# EAGLE design Tesseract (EAGLE 6.6.0)
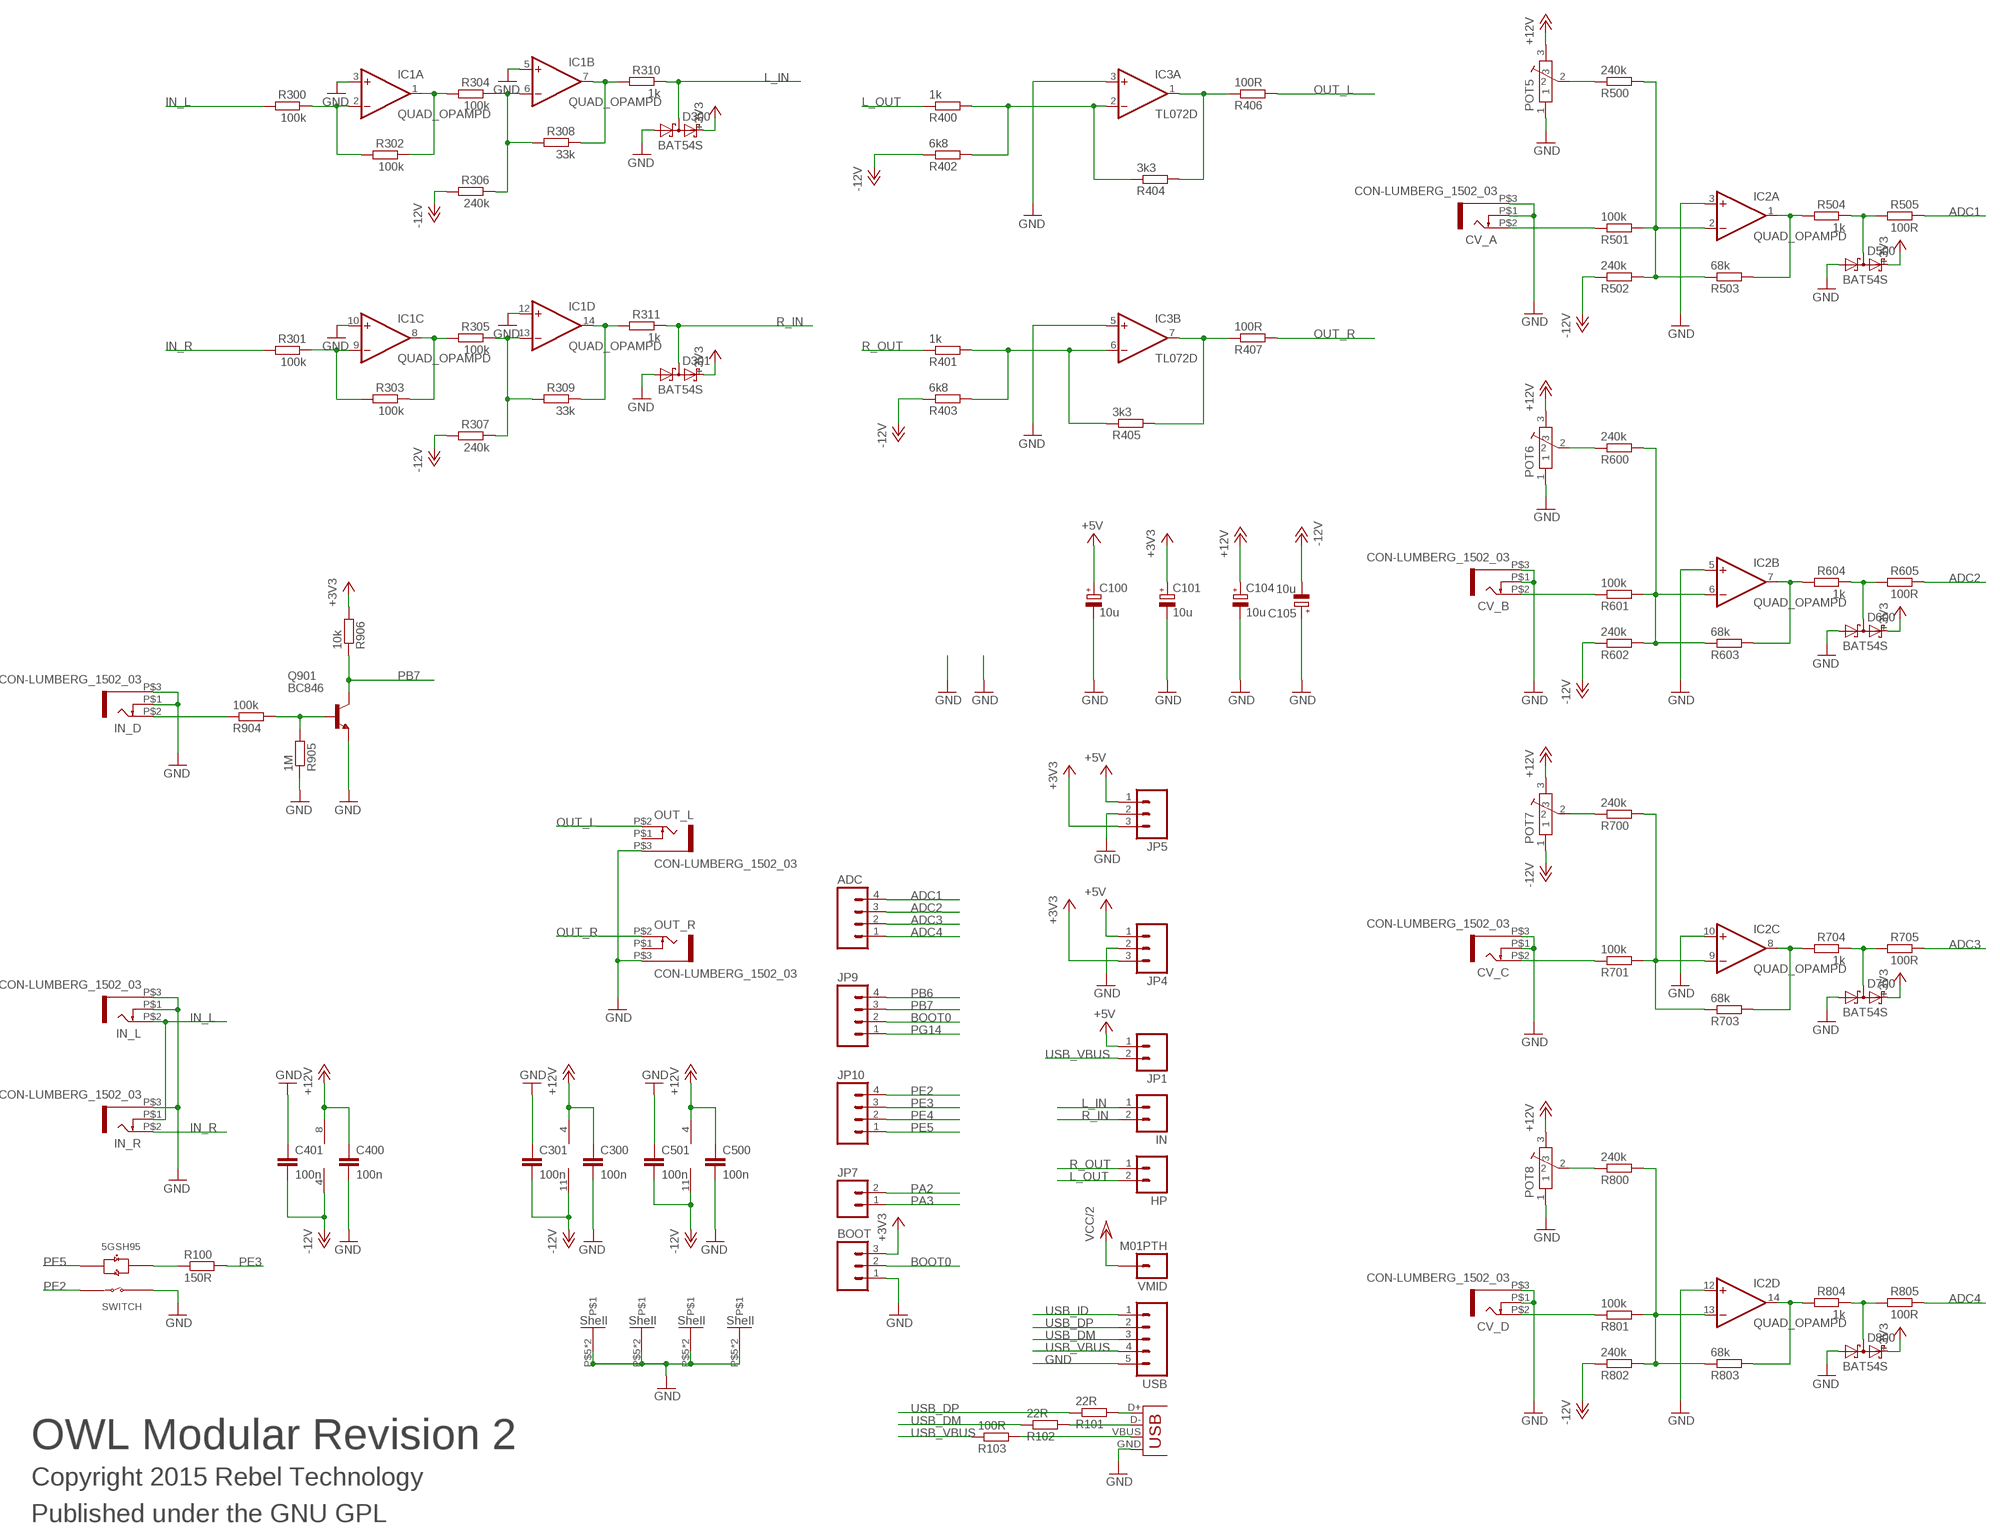
[diagram p0: schematic, sheet 1]

## Parts
ADC  M04PTH  [1X04]
BOOT  M03PTH  [1X03]
C100  10u  CPOL-EUA  [PANASONIC_A]
C101  10u  CPOL-EUA  [PANASONIC_A]
C104  10u  CPOL-EUA  [PANASONIC_A]
C105  10u  CPOL-EUA  [PANASONIC_A]
C300  100n  C-EUC0603  [C0603]
C301  100n  C-EUC0603  [C0603]
C400  100n  C-EUC0603  [C0603]
C401  100n  C-EUC0603  [C0603]
C500  100n  C-EUC0603  [C0603]
C501  100n  C-EUC0603  [C0603]
CV_A  CON-LUMBERG_1502_03  [CON-LUMBERG_1502_03]
CV_B  CON-LUMBERG_1502_03  [CON-LUMBERG_1502_03]
CV_C  CON-LUMBERG_1502_03  [CON-LUMBERG_1502_03]
CV_D  CON-LUMBERG_1502_03  [CON-LUMBERG_1502_03]
D300  BAT54S  [SOT23]
D301  BAT54S  [SOT23]
D500  BAT54S  [SOT23]
D600  BAT54S  [SOT23]
D700  BAT54S  [SOT23]
D800  BAT54S  [SOT23]
HP  M02PTH  [1X02]
IC1  QUAD_OPAMPD  [SO14]
IC2  QUAD_OPAMPD  [SO14]
IC3  TL072D  [SO08]
IN  M02PTH  [1X02]
IN_D  CON-LUMBERG_1502_03  [CON-LUMBERG_1502_03]
IN_L  CON-LUMBERG_1502_03  [CON-LUMBERG_1502_03]
IN_R  CON-LUMBERG_1502_03  [CON-LUMBERG_1502_03]
JP1  M02PTH  [1X02]
JP4  M03PTH  [1X03]
JP5  M03PTH  [1X03]
JP7  M02PTH  [1X02]
JP9  M04PTH  [1X04]
JP10  M04PTH  [1X04]
OUT_L  CON-LUMBERG_1502_03  [CON-LUMBERG_1502_03]
OUT_R  CON-LUMBERG_1502_03  [CON-LUMBERG_1502_03]
POT5  POT-ALPS-RK09L1140  [POT-ALPS-RK09L1140]
POT6  POT-ALPS-RK09L1140  [POT-ALPS-RK09L1140]
POT7  POT-ALPS-RK09L1140  [POT-ALPS-RK09L1140]
POT8  POT-ALPS-RK09L1140  [POT-ALPS-RK09L1140]
Q901  BC846  [SOT23]
R100  150R  R-EU_0603  [0603]
R101  22R  R-EU_0603  [0603]
R102  22R  R-EU_0603  [0603]
R103  100R  R-EU_0603  [0603]
R300  100k  R-EU_0603  [0603]
R301  100k  R-EU_0603  [0603]
R302  100k  R-EU_0603  [0603]
R303  100k  R-EU_0603  [0603]
R304  100k  R-EU_0603  [0603]
R305  100k  R-EU_0603  [0603]
R306  240k  R-EU_0603  [0603]
R307  240k  R-EU_0603  [0603]
R308  33k  R-EU_0603  [0603]
R309  33k  R-EU_0603  [0603]
R310  1k  R-EU_0603  [0603]
R311  1k  R-EU_0603  [0603]
R400  1k  R-EU_0603  [0603]
R401  1k  R-EU_0603  [0603]
R402  6k8  R-EU_0603  [0603]
R403  6k8  R-EU_0603  [0603]
R404  3k3  R-EU_0603  [0603]
R405  3k3  R-EU_0603  [0603]
R406  100R  R-EU_0603  [0603]
R407  100R  R-EU_0603  [0603]
R500  240k  R-EU_0603  [0603]
R501  100k  R-EU_0603  [0603]
R502  240k  R-EU_0603  [0603]
R503  68k  R-EU_0603  [0603]
R504  1k  R-EU_0603  [0603]
R505  100R  R-EU_0603  [0603]
R600  240k  R-EU_0603  [0603]
R601  100k  R-EU_0603  [0603]
R602  240k  R-EU_0603  [0603]
R603  68k  R-EU_0603  [0603]
R604  1k  R-EU_0603  [0603]
R605  100R  R-EU_0603  [0603]
R700  240k  R-EU_0603  [0603]
R701  100k  R-EU_0603  [0603]
R703  68k  R-EU_0603  [0603]
R704  1k  R-EU_0603  [0603]
R705  100R  R-EU_0603  [0603]
R800  240k  R-EU_0603  [0603]
R801  100k  R-EU_0603  [0603]
R802  240k  R-EU_0603  [0603]
R803  68k  R-EU_0603  [0603]
R804  1k  R-EU_0603  [0603]
R805  100R  R-EU_0603  [0603]
R904  100k  R-EU_0603  [0603]
R905  1M  R-EU_0603  [0603]
R906  10k  R-EU_0603  [0603]
U$1  5GTH9  [5GTH9]
USB  M05PTH  [1X05]
VMID  M01PTH  [1X01]
X1  USBPTH-VERTICAL  [USB-B-PTH-VERTICAL]

## Nets
+3V3: BOOT.3 C101.+ D300.2(C2) D301.2(C2) D500.2(C2) D600.2(C2) D700.2(C2) D800.2(C2) JP4.3 JP5.3 R906.2
+5V: C100.+ JP1.1 JP4.1 JP5.1
+12V: C104.+ C300.1 C400.1 C500.1 IC1.4(P:V+) IC2.4(P:V+) IC3.8(P:V+) POT5.3 POT6.3 POT7.3 POT8.3
-12V: C105.- C301.2 C401.2 C501.2 IC1.11(P:V-) IC2.11(P:V-) IC3.4(P:V-) R306.2 R307.2 R402.1 R403.1 R502.1 R602.1 R802.1
ADC1: ADC.4 R505.1
ADC2: ADC.3 R605.1
ADC3: ADC.2 R705.1
ADC4: ADC.1 R805.1
BOOT0: BOOT.2 JP9.2
GND: BOOT.1 C100.- C101.- C104.- C105.+ C300.2 C301.1 C400.2 C401.1 C500.2 C501.1 CV_A.P$1 CV_A.P$3 CV_B.P$1 CV_B.P$3 CV_C.P$1 CV_C.P$3 CV_D.P$1 CV_D.P$3 D300.1(A1) D301.1(A1) D500.1(A1) D600.1(A1) D700.1(A1) D800.1(A1) IC1.3(A:+IN) IC1.5(B:+IN) IC1.10(C:+IN) IC1.12(D:+IN) IC2.3(A:+IN) IC2.5(B:+IN) IC2.10(C:+IN) IC2.12(D:+IN) IC3.3(A:+IN) IC3.5(B:+IN) IN_D.P$1 IN_D.P$3 IN_L.P$1 IN_L.P$3 IN_R.P$3 JP4.2 JP5.2 OUT_L.P$3 OUT_R.P$3 POT5.1 POT5.P$5 POT5.P$6 POT6.1 POT6.P$5 POT6.P$6 POT7.P$5 POT7.P$6 POT8.1 POT8.P$5 POT8.P$6 Q901.2(E) R905.1 U$1.1(SWITCH_B) USB.5 X1.GND
IN_L: IN_L.P$2 IN_R.P$1 R300.2
IN_R: IN_R.P$2 R301.2
L_IN: D300.3(C1A2) IN.1 R310.1
L_OUT: HP.2 R400.1
N$1: IC1.1(A:OUT) R302.1 R304.2
N$2: POT7.1
N$3: CV_A.P$2 R501.1
N$4: IC1.8(C:OUT) R303.1 R305.2
N$5: IC1.9(C:-IN) R301.1 R303.2
N$7: IC1.13(D:-IN) R305.1 R307.1 R309.2
N$9: IC1.2(A:-IN) R300.1 R302.2
N$10: R100.1 U$1.+3(LED_R+)
N$13: IC2.2(A:-IN) R500.2 R501.2 R502.2 R503.1
N$14: POT5.2 R500.1
N$16: D500.3(C1A2) R504.1 R505.2
N$17: IC2.1(A:OUT) R503.2 R504.2
N$19: CV_B.P$2 R601.1
N$20: IC2.6(B:-IN) R600.2 R601.2 R602.2 R603.1
N$21: POT6.2 R600.1
N$22: IC2.7(B:OUT) R603.2 R604.2
N$23: D600.3(C1A2) R604.1 R605.2
N$25: CV_C.P$2 R701.1
N$26: IC2.9(C:-IN) R700.2 R701.2 R703.1
N$27: POT7.2 R700.1
N$28: IC2.8(C:OUT) R703.2 R704.2
N$29: D700.3(C1A2) R704.1 R705.2
N$31: CV_D.P$2 R801.1
N$32: IC1.6(B:-IN) R304.1 R306.1 R308.2
N$33: IC2.13(D:-IN) R800.2 R801.2 R802.2 R803.1
N$34: POT8.2 R800.1
N$35: IC2.14(D:OUT) R803.2 R804.2
N$36: D800.3(C1A2) R804.1 R805.2
N$37: Q901.1(B) R904.2 R905.2
N$39: IC3.1(A:OUT) R404.2 R406.1
N$40: IC3.7(B:OUT) R405.2 R407.1
N$41: IC3.2(A:-IN) R400.2 R402.2 R404.1
N$42: IC3.6(B:-IN) R401.2 R403.2 R405.1
N$46: IN_D.P$2 R904.1
N$51: R101.2 X1.D+
N$52: R102.2 X1.D-
N$53: IC1.14(D:OUT) R309.1 R311.2
N$54: R103.2 X1.VBUS
N$55: IC1.7(B:OUT) R308.1 R310.2
OUT_L: OUT_L.P$2 R406.2
OUT_R: OUT_R.P$2 R407.2
PA2: JP7.2
PA3: JP7.1
PB6: JP9.4
PB7: JP9.3 Q901.3(C) R906.1
PE2: JP10.4 U$1.4(SWITCH_A)
PE3: JP10.3 R100.2
PE4: JP10.2
PE5: JP10.1 U$1.-2(LED_G+)
PG14: JP9.1
R_IN: D301.3(C1A2) IN.2 R311.1
R_OUT: HP.1 R401.1
USB_DM: R102.1 USB.3
USB_DP: R101.1 USB.2
USB_ID: USB.1
USB_VBUS: JP1.2 R103.1 USB.4
VCC/2: VMID.1
Unconnected: OUT_L.P$1 OUT_R.P$1

## Notes on the sheet
- OWL Modular Revision 2
- Copyright 2015 Rebel Technology
- Published under the GNU GPL

## Library data of the parts
ADC JP9 JP10 = SparkFun:M04: Header 4 Standard 4-pin 0.1" header. Use with straight break away headers (SKU : PRT-00116), right angle break away headers (PRT-00553), swiss pins (PRT-00743), machine pins (PRT-00117), and female headers (PRT-00115). Molex polarized connector foot print use with SKU : PRT-08231 with associated crimp pins and housings. 1MM SMD Version SKU: PRT-10208
BOOT JP4 JP5 = SparkFun:M03: Header 3 Standard 3-pin 0.1" header. Use with straight break away headers (SKU : PRT-00116), right angle break away headers (PRT-00553), swiss pins (PRT-00743), machine pins (PRT-00117), and female headers (PRT-00115). Molex polarized connector foot print use with SKU : PRT-08232 with associated crimp pins and housings.
C100 C101 C104 C105 = resistor:CPOL-EU: POLARIZED CAPACITOR, European symbol
C300 C301 C400 C401 C500 C501 = resistor:C-EU: CAPACITOR, European symbol
CV_A CV_B CV_C CV_D IN_D IN_L IN_R OUT_L OUT_R = Rebel:CON-LUMBERG_1502_03
D300 D301 D500 D600 D700 D800 = diode:BAT54S: Schottky Diodes Pin connection corrected 2011-05-04 Source: Fairchild .. BAT54.pdf
HP IN JP1 JP7 = SparkFun:M02: Header 2 Standard 2-pin 0.1" header. Use with straight break away headers (SKU : PRT-00116), right angle break away headers (PRT-00553), swiss pins (PRT-00743), machine pins (PRT-00117), and female headers (PRT-00115). Molex polarized connector foot print use with SKU : PRT-08233 with associated crimp pins and housings.
IC1 IC2 = adafruit:QUAD_OPAMP: OP AMP Standard quad package
IC3 = linear:TL072: OP AMP
POT5-POT8 = Rebel:POT-ALPS-RK09L
Q901 = transistor:BC846: NPN TRANSISTOR
R100-R103 R300-R311 R400-R407 R500-R505 R600-R605 R700 R701 R703-R705 R800-R805 R904-R906 = Rebel:R-EU_: RESISTOR, European symbol
U$1 = SWITCH-5GTH9:5GTH9
USB = SparkFun:M05: Header 5 Standard 5-pin 0.1" header. Use with straight break away headers (SKU : PRT-00116), right angle break away headers (PRT-00553), swiss pins (PRT-00743), machine pins (PRT-00117), and female headers (PRT-00115). Molex polarized connector foot print use with SKU : PRT-08230 with associated crimp pins and housings.
VMID = SparkFun:M01: Header 1 Standard 1-pin 0.1" header. Use with straight break away headers (SKU : PRT-00116), right angle break away headers (PRT-00553), swiss pins (PRT-00743), machine pins (PRT-00117), and female headers (PRT-00115).
X1 = SparkFun:USB: USB Connectors USB-B-PTH is fully proven SKU : PRT-00139 USB-miniB is fully proven SKU : PRT-00587 USB-A-PCB is untested. USB-A-H is throughly reviewed, but untested. Spark Fun Electronics SKU : PRT-00437 USB-B-SMT is throughly reviewed, but untested. Needs silkscreen touching up. USB-A-S has not been used/tested USB-MB-H has not been used/tested

## Board
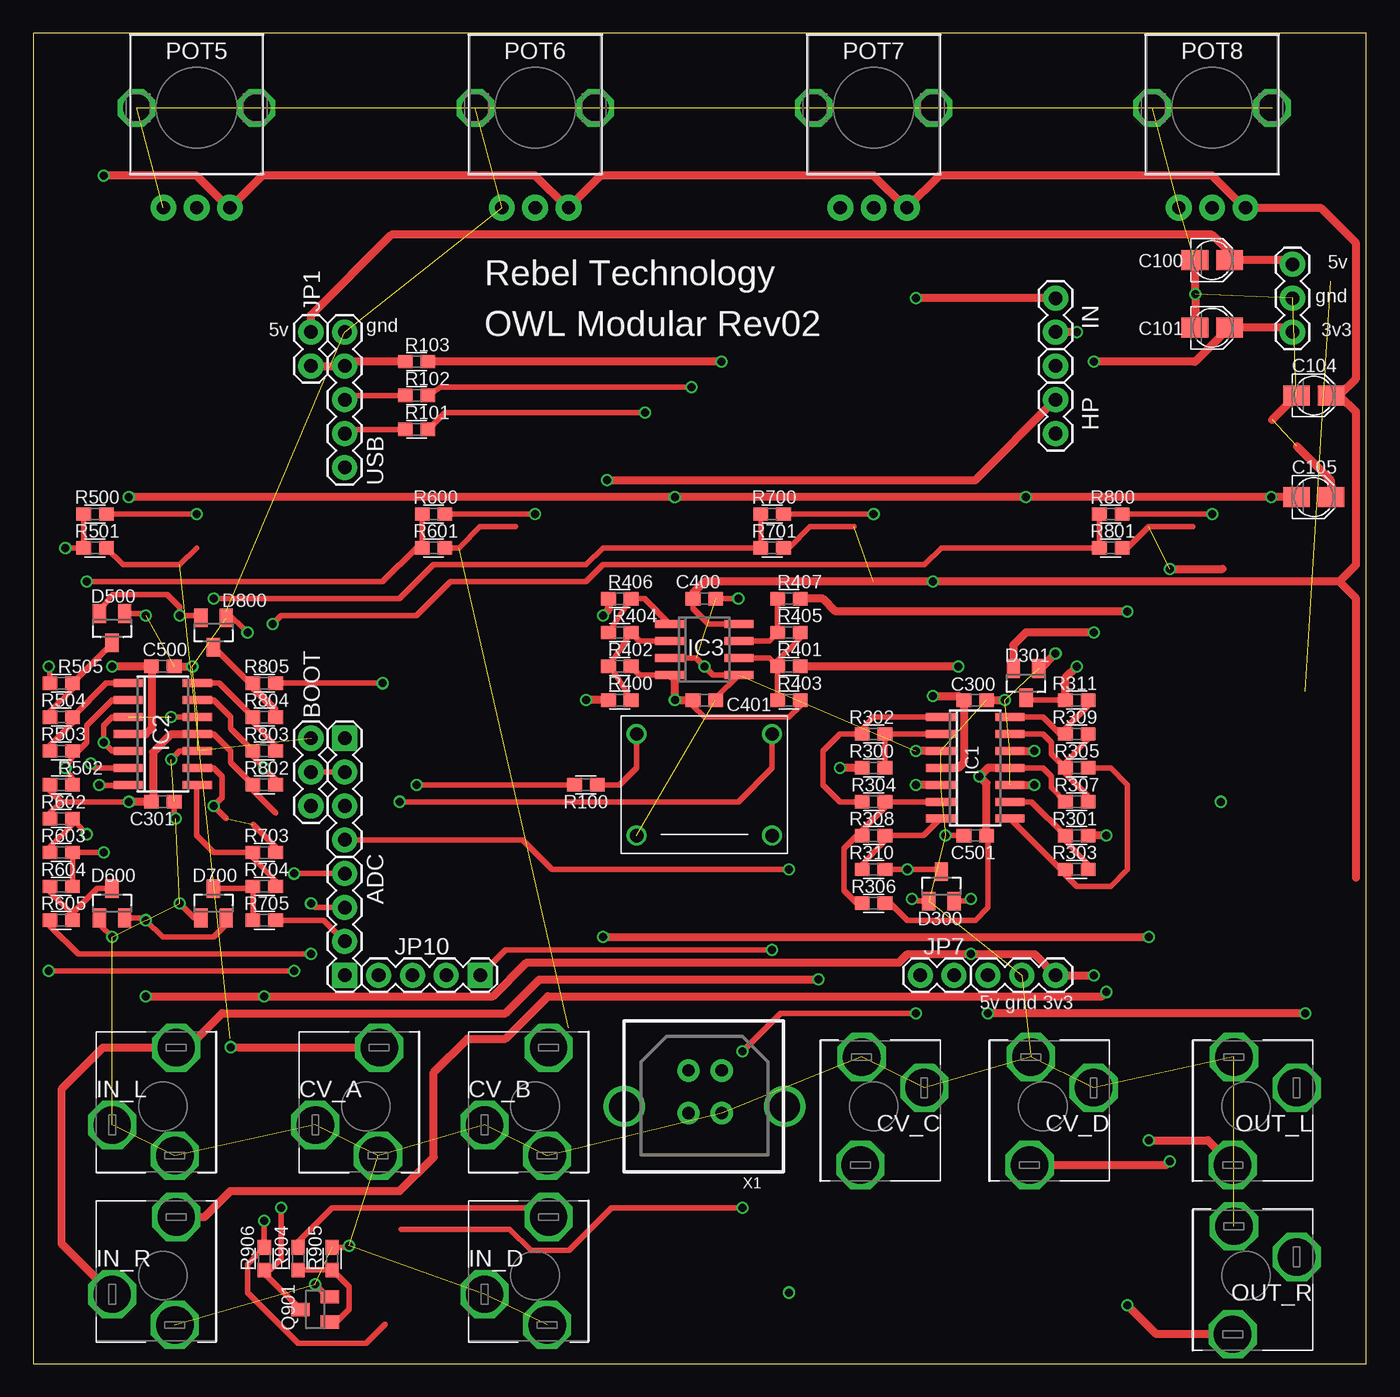
[diagram p1: board, top side]
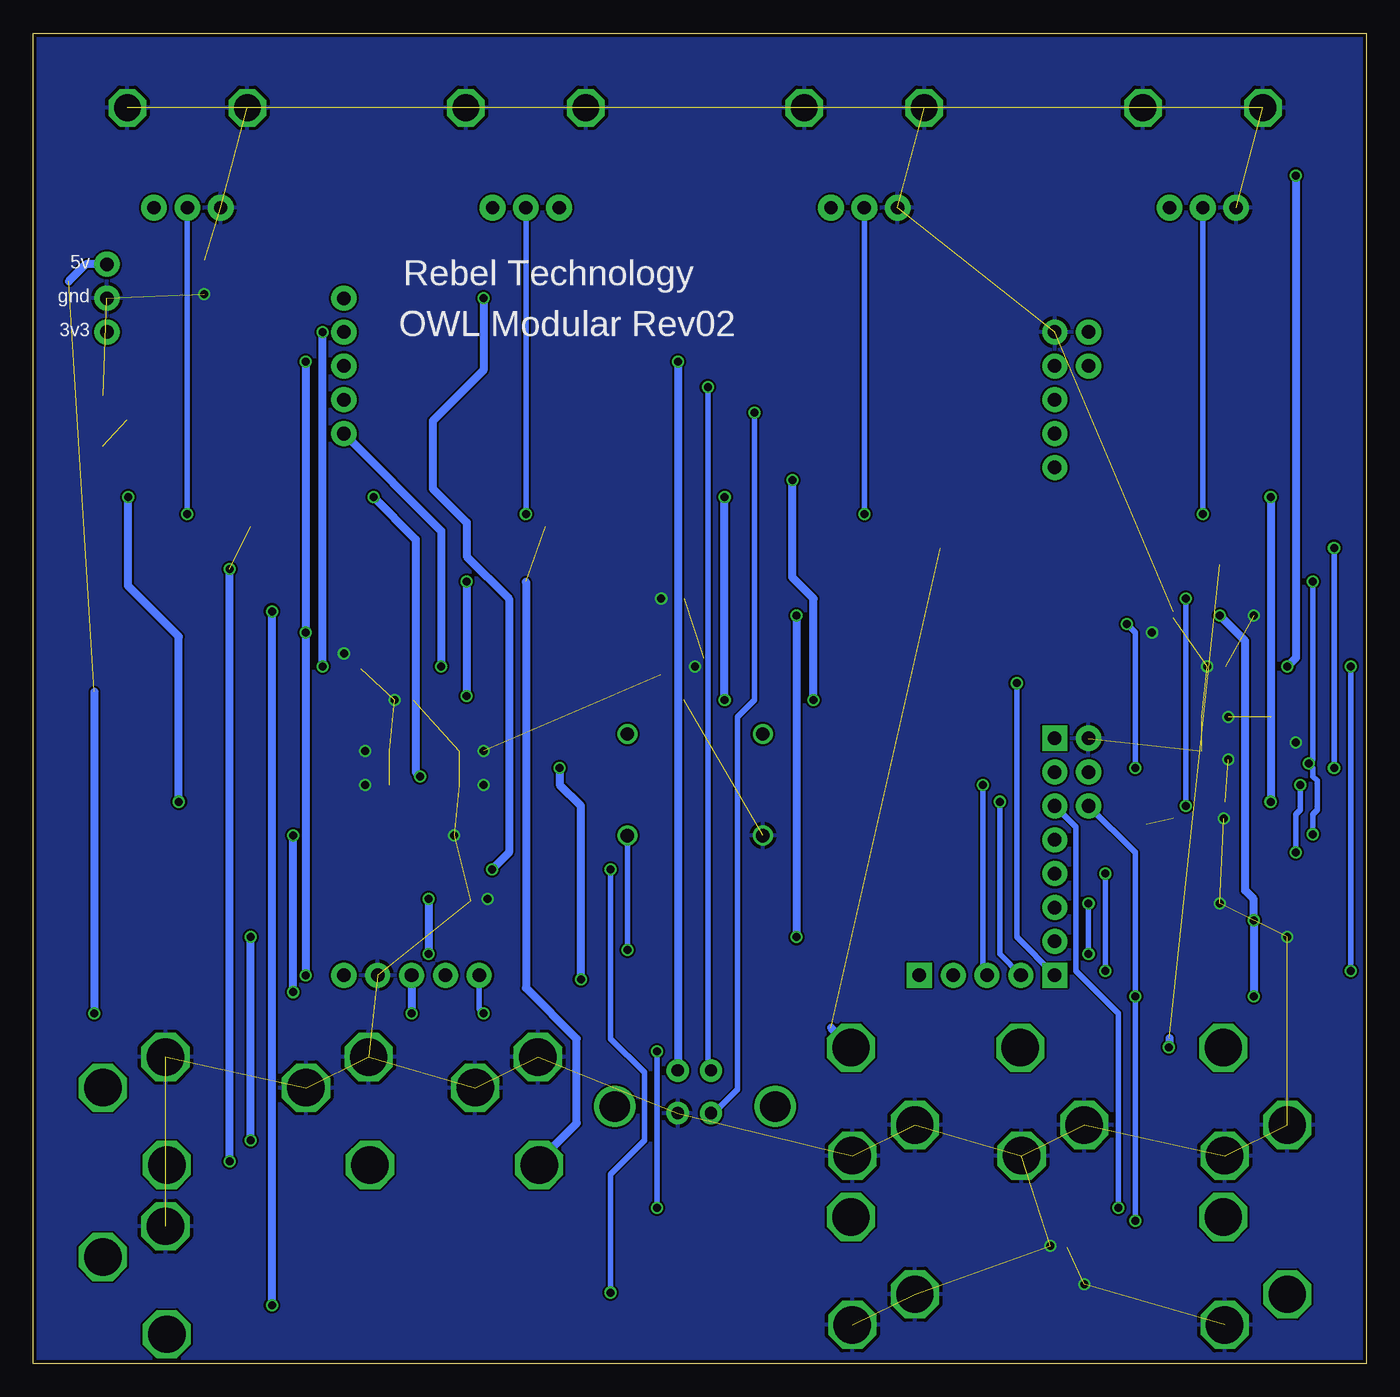
[diagram p2: board, bottom side, seen from below]

Size 100.01 x 99.82 mm. Coordinates in mm from the lower left corner, seen from the top.
Outline: 0,0 100.01,0 100.01,99.82 0,99.82 0,0
Copper layers (1*16): Top 0.035mm / dielectric 1.5mm / Bottom 0.035mm
Design rules "Rebel *": minimum track width 6mil, minimum drill 12mil, track to track 6mil, track to pad 6mil, pad to pad 6mil, via to via 6mil, smd to smd 0mil, copper to edge 10mil, drill to drill 10mil, minimum pad ring 10mil, minimum via ring 6mil, stop-mask expansion 2mil, vias tented up to drill 100mil, thermal gap 10mil

### Footprints (pad centres in the part's own frame; a part is rotated, then mirrored left to right if it is on the bottom)
1X04 = drill 1.016 pad 1.88 square: 1 0,0 | drill 1.016 pad 1.88: 2 2.54,0; 3 5.08,0; 4 7.62,0
1X03 = drill 1.016 pad 1.88: 1 0,0; 2 2.54,0; 3 5.08,0
PANASONIC_A = smd 2 x 1.5: + 1.3,0; - -1.3,0
C0603 = smd 1.1 x 1: 1 -0.85,0; 2 0.85,0
CON-LUMBERG_1502_03 = drill 2.8 octagon: P$1 -3.8,-1.4; P$2 1,4.4; P$3 0.9,-3.7
SOT23 = smd 1 x 1.4: 1 -0.95,-1.1; 2 0.95,-1.1; 3 0,1.1
1X02 = drill 1.016 pad 1.88: 1 0,0; 2 2.54,0
SO14 = smd 0.6 x 2.2: 1 -3.81,-2.6; 2 -2.54,-2.6; 3 -1.27,-2.6; 4 0,-2.6; 5 1.27,-2.6; 6 2.54,-2.6; 7 3.81,-2.6; 8 3.81,2.6; 9 2.54,2.6; 10 1.27,2.6; 11 0,2.6; 12 -1.27,2.6; 13 -2.54,2.6; 14 -3.81,2.6
SO08 = smd 0.6 x 2.2: 1 -1.905,-2.6; 2 -0.635,-2.6; 3 0.635,-2.6; 4 1.905,-2.6; 5 1.905,2.6; 6 0.635,2.6; 7 -0.635,2.6; 8 -1.905,2.6
POT-ALPS-RK09L1140 = drill 1 pad 1.93: 1 -2.5,-7.5; 2 0,-7.5; 3 2.5,-7.5 | drill 2 octagon: P$5 -4.5,0; P$6 4.5,0
0603 = smd 1.1 x 1: 1 -0.85,0; 2 0.85,0
5GTH9 = drill 1: 1 5.08,3.81; 4 -5.08,-3.81; +3 5.08,-3.81; -2 -5.08,3.81
1X05 = drill 1.016 pad 1.88: 1 0,0; 2 2.54,0; 3 5.08,0; 4 7.62,0; 5 10.16,0
1X01 = drill 1.016 pad 1.88: 1 0,0
USB-B-PTH-VERTICAL = drill 0.914 pad 1.676: D+ -1.194,-0.508; D- -1.194,2.692; GND 1.295,-0.508; VBUS 1.295,2.692 | drill 2.286: P$1 -6.02,0; P$2 6.02,0

### Placement (x,y rotation side)
ADC  23.37,29.15 90 top
BOOT  20.83,46.93 270 top
C100  88.46,82.8 0 top
C101  88.46,77.72 0 top
C104  96.08,72.64 0 top
C105  96.08,65.02 0 top
C300  70.68,49.78 0 top
C301  9.72,42.16 180 top
C400  50.36,57.4 0 top
C401  50.36,49.78 180 top
C500  9.72,52.32 0 top
C501  70.68,39.62 0 top
CV_A  24.96,19.3 0 top
CV_B  37.66,19.3 0 top
CV_C  63.06,19.3 180 top
CV_D  75.76,19.3 180 top
D300  68.14,35.81 0 top
D301  74.49,51.05 180 top
D500  5.91,55.18 180 top
D600  5.91,34.54 0 top
D700  13.53,34.54 0 top
D800  13.53,54.86 180 top
HP  76.71,69.79 90 top
IC1  70.68,44.7 270 top
IC2  9.72,47.24 270 top
IC3  50.36,53.59 270 top
IN  76.71,79.95 270 top
IN_D  37.66,6.6 0 top
IN_L  9.72,19.3 0 top
IN_R  9.72,6.6 0 top
JP1  20.83,77.41 270 top
JP4  94.49,82.49 270 top
JP5  71.63,29.15 0 top
JP7  69.09,29.15 180 top
JP9  23.37,46.93 270 top
JP10  33.53,29.15 180 top
OUT_L  91,19.3 180 top
OUT_R  91,6.6 180 top
POT5  12.26,94.23 0 top
POT6  37.66,94.23 0 top
POT7  63.06,94.23 0 top
POT8  88.46,94.23 0 top
Q901  21.15,4.06 90 top
R100  41.47,43.43 180 top
R101  28.77,70.1 0 top
R102  28.77,72.64 0 top
R103  28.77,75.18 0 top
R300  63.06,44.7 180 top
R301  78.3,39.62 0 top
R302  63.06,47.24 0 top
R303  78.3,37.08 0 top
R304  63.06,42.16 180 top
R305  78.3,44.7 0 top
R306  63.06,34.54 0 top
R307  78.3,42.16 180 top
R308  63.06,39.62 180 top
R309  78.3,47.24 0 top
R310  63.06,37.08 180 top
R311  78.3,49.78 0 top
R400  44.01,49.78 0 top
R401  56.71,52.32 180 top
R402  44.01,52.32 180 top
R403  56.71,49.78 180 top
R404  44.01,54.86 180 top
R405  56.71,54.86 180 top
R406  44.01,57.4 180 top
R407  56.71,57.4 0 top
R500  4.64,63.75 180 top
R501  4.64,61.21 180 top
R502  2.1,43.43 0 top
R503  2.1,45.97 180 top
R504  2.1,48.51 0 top
R505  2.1,51.05 0 top
R600  30.04,63.75 180 top
R601  30.04,61.21 180 top
R602  2.1,40.89 0 top
R603  2.1,38.35 0 top
R604  2.1,35.81 0 top
R605  2.1,33.27 0 top
R700  55.44,63.75 180 top
R701  55.44,61.21 180 top
R703  17.34,38.35 180 top
R704  17.34,35.81 0 top
R705  17.34,33.27 180 top
R800  80.84,63.75 180 top
R801  80.84,61.21 180 top
R802  17.34,43.43 0 top
R803  17.34,45.97 0 top
R804  17.34,48.51 180 top
R805  17.34,51.05 180 top
R904  19.88,7.87 270 top
R905  22.42,7.87 270 top
R906  17.34,7.87 90 top
U$1  50.36,43.43 180 top
USB  23.37,67.25 90 top
VMID  76.71,74.87 90 top
X1  50.36,19.3 0 top

### Tracks (layer width: path | path; a pad name or v marks a point on that pad's centre or on a via)
+3V3  (via drill 0.6)
  Top 0.406: D700.2 14.48,32.95 13.53,32 9.72,32 v8.45,33.27 8.28,33.44 D600.2 | D800.2 12.41,56.13 v10.99,56.13 10.99,56.77 10.03,57.72 5.91,57.72 4.96,56.45 D500.2 | D300.2 70.21,34.71 v70.36,34.86 | 26.4,2.96 24.96,1.52 19.88,1.52 16.07,5.33 16.07,7.45 R906.2 v17.34,10.73
  Top 0.61: v8.45,27.56 v17.34,27.56 34.48,27.56 37.02,30.1 64.96,30.1 65.6,30.73 v70.36,30.73 75.12,30.73 JP5.3 v79.57,29.15 | JP4.3 94.2,77.72 C101.+ 89.73,77.72 87.19,75.18 v79.57,75.18 | v79.57,54.86 74.49,54.86 73.53,53.91 D301.2
  Bottom 0.406: v17.34,10.73 v17.34,27.56 17.34,38.35 BOOT.3
  Bottom 0.61: v79.57,29.15 v79.57,54.86 v79.57,75.18 | v8.45,27.56 v8.45,33.27 8.45,34.86 9.08,35.5 9.08,54.23 v10.99,56.13 | v70.36,34.86 v70.36,30.73
+5V  (via drill 0.6)  (1 unrouted)
  Top 0.61: v95.44,26.29 v71.63,26.29 | JP4.1 94.2,82.8 C100.+ 90.04,83.09 90.04,83.12 88.46,84.71 26.86,84.71 20.83,78.68 JP1.1
  Bottom 0.61: 95.44,50.42 v95.44,26.29 | JP4.1 96.08,82.49 97.35,81.22 | JP5.1 v71.63,26.29
+12V  (via drill 0.6)
  Top 0.406: IC3.8 50.67,55.5 49.51,56.67 C400.1
  Top 0.61: 99.25,36.45 99.25,57.4 97.98,58.67 | 97.98,58.67 v67.5,58.67 50.36,58.67 49.51,57.82 C400.1 | 97.98,58.67 99.25,59.94 99.25,71.4 98.01,72.64 C104.+ 98.01,72.67 99.25,73.91 99.25,84.07 96.59,86.73 POT8.3 90.88,86.73 88.46,89.15 67.98,89.15 POT7.3 65.48,86.73 63.06,89.15 42.58,89.15 POT6.3 40.08,86.73 37.66,89.15 17.18,89.15 POT5.3 14.68,86.73 12.26,89.15 v5.27,89.15 | IC2.4 8.45,47.24 8.87,47.66 C500.1 v5.91,52.32 | IC1.4 69.41,44.7 69.83,45.12 C300.1 69.41,50.1 v67.5,50.1
  Bottom 0.61: v5.27,89.15 5.27,52.96 v5.91,52.32 | v67.5,58.67 v67.5,50.1
-12V  (via drill 0.6)
  Top 0.406: IC2.11 13.53,47.24 14.8,45.97 14.8,45.12 R802.1 16.49,43.01 18.19,41.31 | R602.1 1.25,41.31 2.1,42.16 | 2.1,42.16 v7.18,42.16 | R502.1 1.25,43.01 2.1,42.16 | R306.2 64.33,34.54 65.6,33.27 70.68,33.27 71.63,34.23 71.63,39.52 C501.2 | IC3.4 45.49,51.69 R402.1 | R403.1 57.56,49.36 56.71,48.51 50.36,48.51 49.51,49.36 C401.2 | IC1.11 75.76,44.7 76.39,44.07 76.39,43.22 R307.2
  Top 0.61: C105.- v92.9,65.02 v74.49,65.02 v48.13,65.02 v7.18,65.02 | IC2.11 10.35,47.24 8.98,45.87 8.98,42.28 C301.2 v7.18,42.16 | IC3.4 48.13,51.31 v48.13,49.78 C401.2 | C501.2 71.53,43.54 v70.99,44.07 71.63,44.7 IC1.11
  Bottom 0.61: v7.18,65.02 v7.18,42.16 | v89.09,42.16 89.09,54.55 92.9,58.36 v92.9,65.02 | v70.99,44.07 71.31,44.39 71.31,61.85 v74.49,65.02 | v48.13,49.78 v48.13,65.02
ADC1  (via drill 0.6)
  Top 0.406: v19.56,29.46 v1.14,29.46 | R505.1 1.25,52.22 v1.14,52.32 | ADC.4 v19.56,36.77
  Bottom 0.406: v19.56,36.77 v19.56,29.46 | v1.14,52.32 v1.14,29.46
ADC2  (via drill 0.6)
  Top 0.406: R605.1 1.25,32.85 3.37,30.73 v20.83,30.73 | ADC.3 21.15,34.23 v20.83,34.54
  Bottom 0.406: v20.83,30.73 v20.83,34.54
ADC3
  Top 0.406: R705.1 21.78,33.27 ADC.2
ADC4  (via drill 0.6)
  Top 0.406: R805.1 v26.23,51.05
  Bottom 0.406: v26.23,51.05 26.23,32 ADC.1
BOOT0
  Top 0.406: BOOT.2 JP9.2
GND  (via drill 0.6)  (55 unrouted)
  Top 0.406: D600.1 4.96,32.95 v5.91,32 | D700.1 12.09,33.44 v10.99,34.54 | D500.1 8.28,56.28 v8.45,56.13 | D800.1 14.48,56.45 v16.07,54.86 | IC2.3 5.91,48.51 5.27,47.88 v5.27,46.61 5.91,45.97 IC2.5 | IC2.12 v10.35,48.51 | IC2.10 10.99,45.97 v10.35,45.34 | C301.1 10.57,41.31 v10.67,40.89 | C501.1 v68.45,39.62 | D300.1 66.06,34.71 v65.91,34.86 | IC3.3 49.72,52.96 v50.36,52.32 50.99,51.69 IC3.5 51.21,49.94 C401.1 | C400.2 v52.9,57.4 | Q901.2 22.1,5.01 v21.15,5.97 | R905.1 23.58,8.72 v23.69,8.83
  Top 0.61: C100.- 87.16,80.29 v87.19,80.26 87.19,77.75 C101.- | 92.96,70.82 C104.- | 94.81,68.83 97.35,66.29 97.35,65.05 C105.+ | C500.2 v11.94,52.32 | D301.1 75.59,52.15 v76.71,53.28 | IC1.12 v75.12,45.97 | IC1.10 v75.12,43.43 | C300.2 v72.9,49.78 | IC1.3 v66.23,45.97 | IC1.5 v66.23,43.43
  pour Bottom: -8.06,-1.65 -8.06,102.49 108.46,102.49 108.46,-1.65
IN_L  (via drill 0.6)
  Top 0.61: IN_R.P$1 2.1,9.02 2.1,20.57 5.23,23.7 IN_L.P$2 11.58,23.7 14.16,26.29 35.43,26.29 37.97,28.83 v58.93,28.83 | R300.2 v60.52,44.7
  Bottom 0.61: v60.52,44.7 60.52,43.43 58.93,41.85 v58.93,28.83
IN_R  (via drill 0.6)
  Top 0.61: IN_R.P$2 12.85,11 14.8,12.95 27.5,12.95 30.04,15.49 30.04,21.84 32.58,24.38 35.43,24.38 38.61,27.56 80.2,27.56 v80.52,27.88 | v80.52,39.62 R301.2
  Bottom 0.61: v80.52,27.88 v80.52,39.62
L_IN  (via drill 0.6)
  Top 0.406: R310.1 v65.6,37.08 67.97,37.08 D300.3
  Top 0.61: IN.1 v66.23,79.95
  Bottom 0.61: v66.23,79.95 66.23,74.55 70.04,70.74 70.04,65.66 67.5,63.12 67.5,60.58 64.33,57.4 64.33,38.35 v65.6,37.08
L_OUT  (via drill 0.6)
  Top 0.61: R400.1 v41.47,49.78 | v43.05,66.29 70.68,66.29 HP.2
  Bottom 0.61: v41.47,49.78 41.47,57.4 43.05,58.99 v43.05,66.29
N$1
  Top 0.406: 68.08,48.57 IC1.1 63.06,48.51 62.21,47.66 R302.1 60.52,47.24 59.25,45.97 59.25,43.43 60.52,42.16 R304.2
N$3  (via drill 0.6)  (1 unrouted)
  Top 0.406: 12.26,61.21 10.99,59.94 6.76,59.94 R501.1
  Top 0.61: CV_A.P$2 15.48,23.7 v14.8,23.75
  Bottom 0.61: 14.76,24.42 v14.8,23.75
N$4
  Top 0.406: R305.2 80.84,44.7 82.11,43.43 82.11,37.08 80.84,35.81 78.3,35.81 77.45,36.66 R303.1 77.09,37.08 IC1.8
N$5
  Top 0.406: R303.2 79.15,37.5 77.45,39.2 R301.1 74.91,42.16 IC1.9
N$7
  Top 0.406: R309.2 79.15,46.82 77.45,45.12 R305.1 | R305.1 77.45,44.28 79.15,42.58 R307.1 | IC1.13 75.76,47.24 76.39,46.61 76.39,45.76 R305.1
N$9
  Top 0.406: IC1.2 R302.2 R300.1
N$10
  Top 0.406: R100.1 44.01,43.43 45.28,44.7 U$1.+3
N$13  (via drill 0.6)
  Top 0.406: IC2.2 5.91,49.78 4,47.88 4,46.61 3.37,45.97 R503.1 2.95,45.55 v2.41,44.7 2.95,43.85 R502.2 | R500.2 R501.2 v2.41,61.21
  Bottom 0.406: v2.41,61.21 v2.41,44.7
N$14  (via drill 0.6)
  Top 0.406: v12.26,63.75 R500.1
  Bottom 0.406: POT5.2 v12.26,63.75
N$16
  Top 0.406: R504.1 1.25,48.93 2.95,50.63 R505.2 5.66,53.76 D500.3
N$17
  Top 0.406: IC2.1 5.49,51.05 R504.2 2.95,48.09 1.25,46.39 R503.2
N$19  (1 unrouted)
  Top 0.406: R601.1 31.94,61.21 33.53,62.8 36.19,62.8
  Bottom 0.61: 40.16,25.2 CV_B.P$2
N$20  (via drill 0.6)
  Top 0.406: R603.1 1.25,38.77 2.95,40.47 R602.2 v4,39.73 | v4.32,45.02 4.64,44.7 IC2.6 | R600.2 R601.2 28.77,61.21 26.23,58.67 v4,58.67
  Bottom 0.406: v4,58.67 4,45.34 v4.32,45.02 4,44.7 4,44.07 3.68,43.75 3.68,41.53 4,41.21 v4,39.73
N$21  (via drill 0.6)
  Top 0.406: v37.66,63.75 R600.1
  Bottom 0.406: POT6.2 v37.66,63.75
N$22  (via drill 0.6)
  Top 0.406: R603.2 3.37,38.35 | IC2.7 7.18,43.37 5.21,43.37 v4.95,43.43 | R604.2 R603.2 | v5.27,38.35 R603.2
  Bottom 0.406: v4.95,43.43 4.95,41.53 5.27,41.21 v5.27,38.35
N$23
  Top 0.406: R604.1 1.25,35.39 2.95,33.69 R605.2 3.05,33.38 3.05,33.91 4.78,35.64 D600.3
N$25  (1 unrouted)
  Top 0.406: R701.1 56.71,61.21 58.29,62.8 61.59,62.8
  Bottom 0.61: 63.06,58.67 63.06,28.19 59.25,24.38 59.25,18.03 62.06,15.22 CV_C.P$2
N$26  (via drill 0.6)  (1 unrouted)
  Top 0.406: R700.2 R701.2 42.74,61.21 41.47,59.94 30.04,59.94 27.5,57.4 v13.53,57.4 | R703.1 18.19,38.77 16.49,40.47 | 14.48,40.89 v13.53,41.85 14.16,42.48 14.16,44.07 13.53,44.7 IC2.9
  Bottom 0.406: v13.53,57.4 v13.53,41.85
N$27  (via drill 0.6)
  Top 0.406: v63.06,63.75 R700.1
  Bottom 0.406: POT7.2 v63.06,63.75
N$28
  Top 0.406: IC2.8 12.26,43.37 12.26,39.62 13.53,38.35 R703.2 16.49,37.93 18.19,36.23 R704.2
N$29
  Top 0.406: D700.3 16.32,35.64 R704.1 16.07,35.81 16.49,35.39 R705.2
N$31  (via drill 0.6)  (1 unrouted)
  Top 0.406: R801.1 82.11,61.21 83.69,62.8 86.99,62.8
  Top 0.61: CV_D.P$2 85.01,14.9 v85.28,15.18 | v85.28,59.63 89.25,59.63
  Bottom 0.61: v85.28,15.18 v85.28,59.63
N$32
  Top 0.406: IC1.6 R304.1 63.91,41.74 62.21,40.04 R308.2 61.79,39.62 60.83,38.67 60.83,35.5 61.79,34.54 R306.1
N$33  (via drill 0.6)
  Top 0.406: IC2.13 13.53,49.78 14.8,48.51 14.8,47.66 R803.1 16.49,45.55 v17.34,44.7 18.19,43.85 R802.2 | v17.97,55.5 18.61,56.13 28.77,56.13 31.31,58.67 41.47,58.67 42.74,59.94 66.87,59.94 68.14,61.21 R801.2 R800.2
  Bottom 0.406: v17.97,55.5 17.34,54.86 v17.34,44.7
N$34  (via drill 0.6)
  Top 0.406: v88.46,63.75 R800.1
  Bottom 0.406: POT8.2 v88.46,63.75
N$35
  Top 0.406: IC2.14 13.95,51.05 R804.2 16.49,48.09 18.19,46.39 R803.2
N$36
  Top 0.406: R805.2 16.49,50.63 18.19,48.93 R804.1 18.19,49.1 D800.3
N$37
  Top 0.406: Q901.1 22.74,3.11 23.69,4.06 23.69,5.75 R905.2 R904.2
N$39
  Top 0.406: R404.2 R406.1 45.85,57.4 IC3.1
N$40
  Top 0.406: R407.1 R405.2 55.22,54.23 IC3.7
N$41
  Top 0.406: R400.2 44.43,50.52 43.59,51.9 R402.2 R404.1 45.49,54.23 IC3.2
N$42
  Top 0.406: IC3.6 55.22,52.96 R401.2 | R401.2 R403.2 | R405.1 57.56,54.44 55.86,52.74 R401.2
N$46
  Top 0.406: R904.1 19.88,9.14 22.42,11.68 37.98,11.68 IN_D.P$2
N$51  (via drill 0.6)
  Top 0.406: v45.91,71.37 30.89,71.37 R101.2
  Bottom 0.406: X1.D+ 48.96,18.8 47.18,20.57 47.18,48.51 45.91,49.78 v45.91,71.37
N$52  (via drill 0.6)
  Top 0.406: v49.4,73.28 30.57,73.28 R102.2
  Bottom 0.406: X1.D- 49.16,21.92 49.4,22.16 v49.4,73.28
N$53
  Top 0.406: IC1.14 75.76,48.51 77.03,47.24 R309.1 77.45,47.66 79.15,49.36 R311.2
N$54  (via drill 0.6)
  Top 0.61: v51.63,75.18 R103.2
  Bottom 0.61: v51.63,75.18 51.63,22.29 X1.VBUS
N$55
  Top 0.406: IC1.7 66.81,39.62 R308.1 63.91,39.2 62.21,37.5 R310.2
OUT_L  (via drill 0.6)
  Top 0.61: R406.2 43.16,56.55 v42.74,56.13 | v42.74,32 v83.69,32 | v83.69,16.76 88.14,16.76 OUT_L.P$2
  Bottom 0.61: v83.69,16.76 v83.69,32 | v42.74,56.13 v42.74,32
OUT_R  (via drill 0.6)
  Top 0.61: OUT_R.P$2 84.28,2.2 v82.11,4.38 | v82.11,56.45 60.2,56.45 59.25,57.4 R407.2
  Bottom 0.61: v82.11,4.38 v82.11,56.45
PA2  (via drill 0.6)
  Top 0.406: v53.21,23.43 56.07,26.29 v66.23,26.29 | v53.21,11.68 43.37,11.68 40.2,8.51 37.34,8.51 35.75,10.1 27.6,10.1
  Bottom 0.406: v53.21,23.43 v53.21,11.68 | JP7.2 66.55,26.61 v66.23,26.29
PB6  (via drill 0.6)
  Top 0.406: JP9.4 36.7,39.31 38.93,37.08 v56.71,37.08
  Bottom 0.406: v56.71,37.08 56.71,24.38 54.17,21.84 54.17,16.76 56.71,14.22 v56.71,5.33
PB7  (via drill 0.6)
  Top 0.406: Q901.3 17.34,6.77 R906.1 17.76,7.02 18.61,7.87 v18.61,11.68
  Bottom 0.406: v18.61,11.68 18.61,26.29 21.78,29.46 21.78,40.26 JP9.3
PE2  (via drill 0.6)
  Top 0.406: U$1.4 55.44,44.7 52.9,42.16 v27.5,42.16
  Bottom 0.406: v27.5,42.16 27.5,30.73 JP10.4
PE3  (via drill 0.6)
  Top 0.406: R100.2 v28.77,43.43
  Bottom 0.406: v28.77,43.43 28.77,29.46 JP10.3
PE5  (via drill 0.6)
  Top 0.406: JP10.1 35.43,31.05 v55.44,31.05
  Bottom 0.406: U$1.-2 v55.44,31.05
R_IN  (via drill 0.6)
  Top 0.406: R311.1 74.66,49.78 D301.3
  Top 0.61: v78.3,77.41 IN.2 | R311.1 77.45,51.47 v78.3,52.32
  Bottom 0.61: v78.3,52.32 v78.3,77.41
R_OUT  (via drill 0.6)
  Top 0.61: v69.41,52.32 R401.1
  Bottom 0.61: HP.1 69.41,62.48 v69.41,52.32
USB_DM
  Top 0.406: R102.1 23.69,72.64 USB.3
USB_DP
  Top 0.406: R101.1 23.69,70.1 USB.2
USB_VBUS
  Top 0.61: JP1.2 USB.4 23.69,75.18 R103.1

### Text on the board
tPlace: 5v | Rebel Technology | gnd | 5v | gnd | OWL Modular Rev02 | 3v3 | 5v | gnd | 3v3
bPlace: 5v | Rebel Technology | gnd | OWL Modular Rev02 | 3v3